# Altium schematic sheet pressiion.SchDoc
size A4
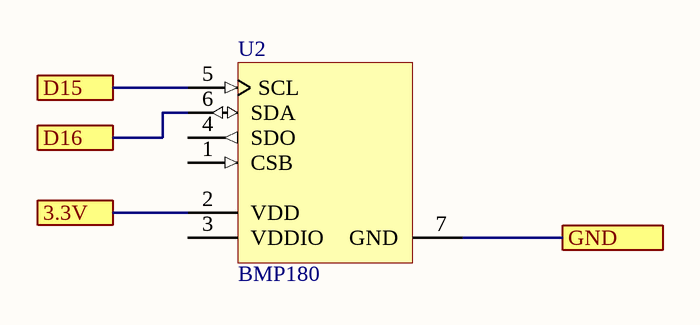
[diagram p0: pressiion.SchDoc]

## Parts
U2  BMP180  [BOSC-BMP180-7_V]

## Ports
3.3V, D15, D16, GND

## Nets
3.3V: U2.2(VDD) ; port 3.3V
D15: U2.5(SCL) ; port D15
D16: U2.6(SDA) ; port D16
GND: U2.7(GND) ; port GND

Not connected (* = marked no-connect by the designer): U2 1(CSB) 3(VDDIO) 4(SDO)

## Library data of the parts
U2 = CMP-2000-05074-1: Digital Pressure Sensor, 1.8 to 3.6 V, -40 to 85 degC, 7-Pin LGA, RoHS; Manufacturer: Bosch Sensortec; Output Type: I²C; Other Names: 0273.300.244-1NV / 828-1027-2; Pressure Type: Absolute; Maximum Pressure: 145.04PSI(1000kPa); Voltage - Supply: 1.62V~3.6V; EDA / CAD Models: DownloadfromAcceleratedDesigns; Accuracy: ±2%; Port Style: NoPort; For Use With: 1528-1434-ND / -BMP180BAROMETRICPRESS/TEMP5V / 1528-1435-ND / -L3GD20HLSM303BMP18010DOFIMU / 1568-1260-ND / -SPARKFUNBAROMETRICPRESSURESEN / 1597-1301-ND / -GROVEBAROMETERSENSOR / 1597-1302-ND / -GROVEIMU10DOF / 1471-1581-ND / -10DOFCLICK / 101040003-ND / -XADOWBAROMETERBMP180V1.0 / 101040004-ND / -XADOW-IMU10DOF / 114990245-ND / -BOARDTPHPRESSURETEMPREV.4 / 828-1028-ND / -BMP180SHUTTLEBOARDFORDEVKIT / 103990031-ND / -TPHBOARDTHETEMPERATUREPRESSU; Operating Pressure: 4.35PSI~15.95PSI(30kPa~110kPa); Output: 16~19b; Supplier Device Package: 7-LGA; Operating Temperature: -40degC~85degC; Standard Package: 5,000; Package / Case: 7-VLGA; Manufacturer URL: http://www.bosch-sensortec.com; Category: Sensors,Transducers; Datasheet URL: http://media.digikey.com/pdf/Data%20Sheets/Bosch/BMP180.pdf; Family: PressureSensors,Transducers; Termination Style: PCB; Datasheet Version: Rev. 2.4, 01/2012